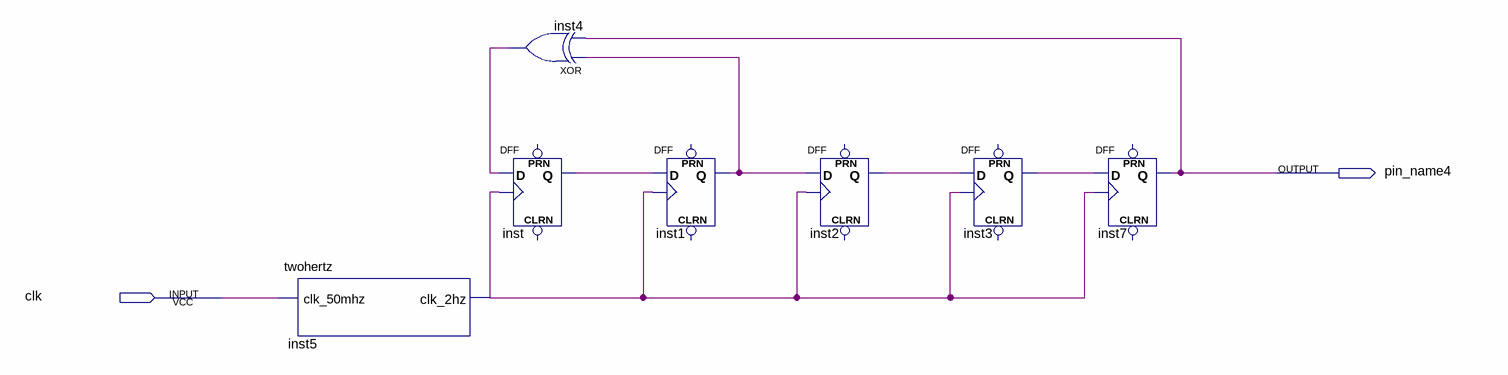
[diagram p0: schematic sheet]
// Quartus schematic rand_blocks.bdf as structural Verilog: 7 symbols, 2 pins
module rand_blocks (
  input  clk,
  output pin_name4
);

  wire inst1_q, inst2_q, inst3_q, inst4_out, inst5_clk_2hz, inst_q;

  twohertz inst5 (.clk_50mhz(clk), .clk_2hz(inst5_clk_2hz));
  xor inst4 (inst4_out, inst1_q, pin_name4);
  DFF inst (.CLK(inst5_clk_2hz), .D(inst4_out), .Q(inst_q));  // open: CLRN, PRN
  DFF inst1 (.CLK(inst5_clk_2hz), .D(inst_q), .Q(inst1_q));  // open: CLRN, PRN
  DFF inst2 (.CLK(inst5_clk_2hz), .D(inst1_q), .Q(inst2_q));  // open: CLRN, PRN
  DFF inst3 (.CLK(inst5_clk_2hz), .D(inst2_q), .Q(inst3_q));  // open: CLRN, PRN
  DFF inst7 (.CLK(inst5_clk_2hz), .D(inst3_q), .Q(pin_name4));  // open: CLRN, PRN
endmodule
